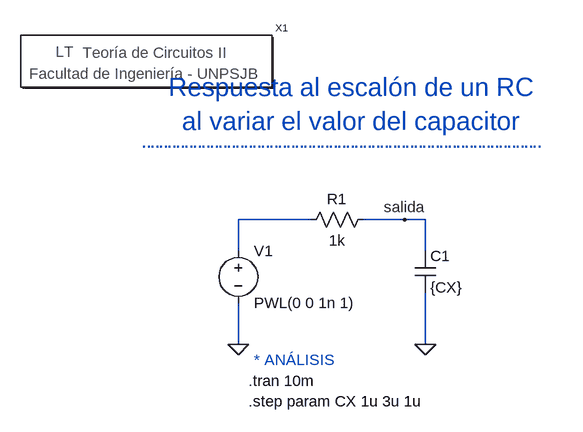
[diagram p0: schematic Respuesta al escalon de un RC al variar el capacitor.asc]
Respuesta al escalon de un RC al variar el capacitor.asc, the LTspice schematic file:
Version 4
SHEET 1 880 680
WIRE 64 160 -48 160
WIRE 208 160 144 160
WIRE 240 160 208 160
WIRE -48 208 -48 160
WIRE 240 208 240 160
WIRE -48 352 -48 288
WIRE 240 352 240 272
FLAG -48 352 0
FLAG 240 352 0
FLAG 208 160 salida
SYMBOL cap 224 208 R0
SYMATTR InstName C1
SYMATTR Value {CX}
SYMBOL voltage -48 192 R0
WINDOW 123 0 0 Left 0
WINDOW 39 0 0 Left 0
SYMATTR InstName V1
SYMATTR Value PWL(0 0 1n 1)
SYMBOL Circuitos2\\Letreros\\Teoría\ de\ Circuitos\ II -192 -80 R0
SYMATTR InstName X1
SYMBOL res 160 144 R90
WINDOW 0 0 56 VBottom 2
WINDOW 3 32 56 VTop 2
SYMATTR InstName R1
SYMATTR Value 1k
TEXT -32 440 Left 2 !.step param CX 1u 3u 1u
TEXT -32 408 Left 2 !.tran 10m
TEXT -24 376 Left 2 ;* ANÁLISIS
TEXT 128 8 Center 4 ;Respuesta al escalón de un RC\nal variar el valor del capacitor\n¨¨¨¨¨¨¨¨¨¨¨¨¨¨¨¨¨¨¨¨¨¨¨¨¨¨¨¨¨¨¨¨¨¨¨¨¨¨¨¨¨¨¨¨¨¨¨

The netlist it stands for:
* Respuesta al escalon de un RC al variar el capacitor.asc
C1 salida 0 {CX}
V1 N001 0 PWL(0 0 1n 1)
XX1 Teoría de Circuitos II
R1 salida N001 1k
.step param CX 1u 3u 1u
.tran 10m
* * ANÁLISIS
* Respuesta al escalón de un RC
* al variar el valor del capacitor
* ¨¨¨¨¨¨¨¨¨¨¨¨¨¨¨¨¨¨¨¨¨¨¨¨¨¨¨¨¨¨¨¨¨¨¨¨¨¨¨¨¨¨¨¨¨¨¨
.backanno
.end